# Altium schematic sheet drive.SchDoc
size A3
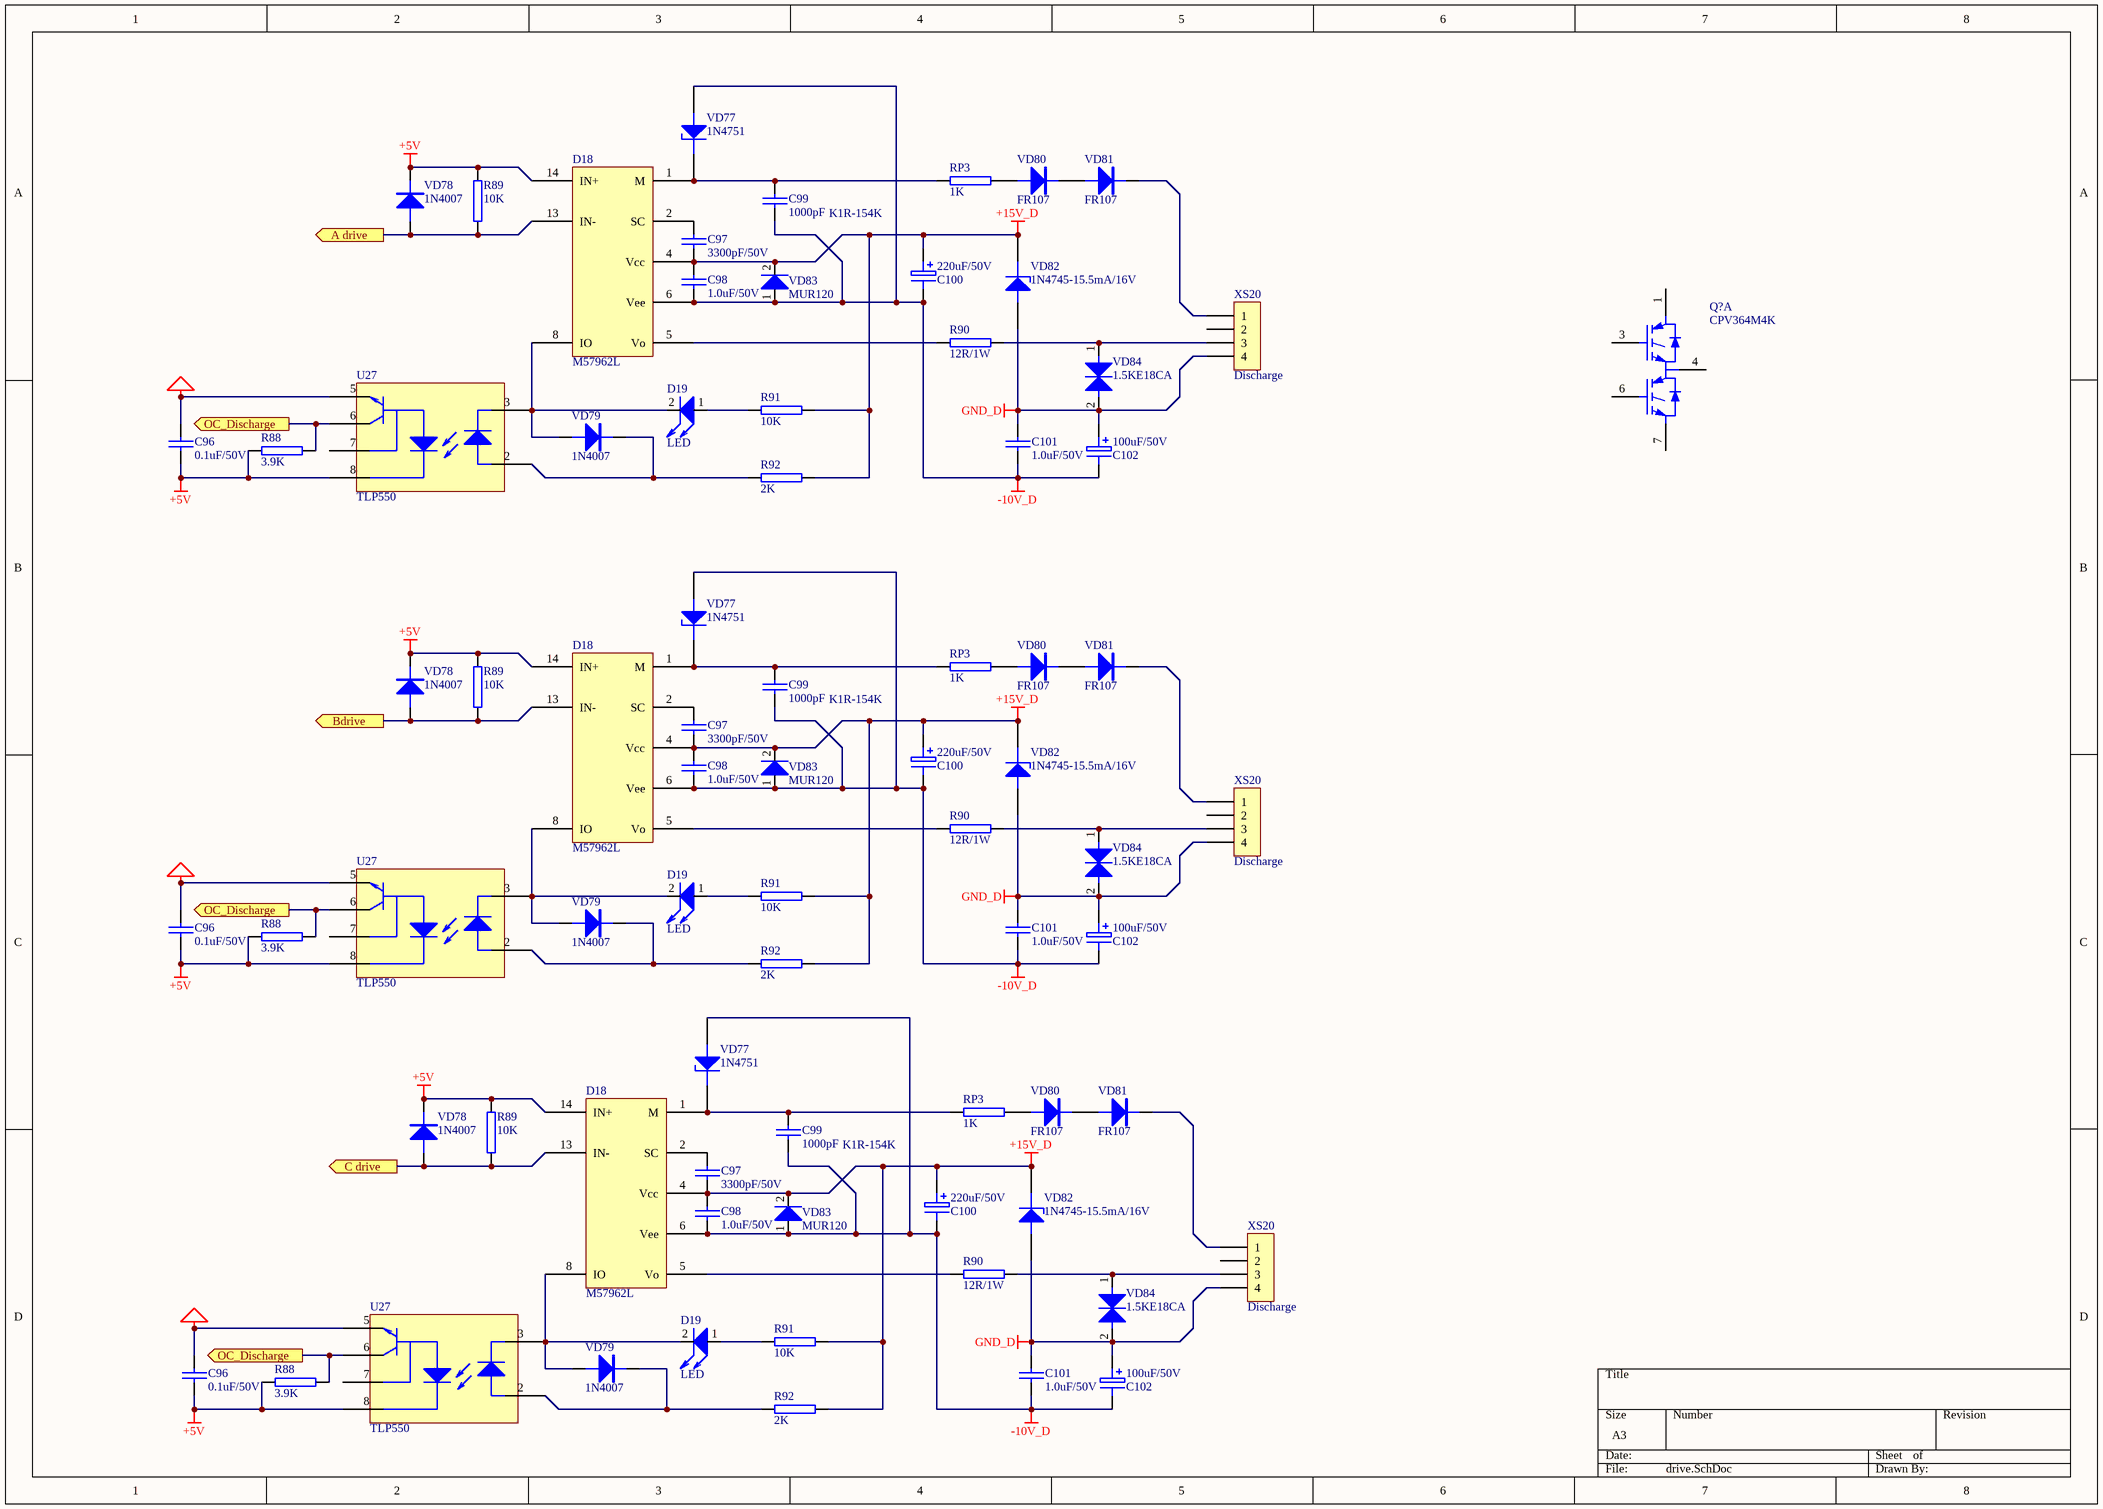
[diagram p0: drive.SchDoc]

## Parts
(Parts that share a designator on the sheet are numbered #1, #2 ... from top to bottom, then left to right.)
C96#1  0.1uF/50V  [RAD0.2]
C96#2  0.1uF/50V  [RAD0.2]
C96#3  0.1uF/50V  [RAD0.2]
C97#1  3300pF/50V  [RAD0.2]
C97#2  3300pF/50V  [RAD0.2]
C97#3  3300pF/50V  [RAD0.2]
C98#1  1.0uF/50V  [RAD0.2]
C98#2  1.0uF/50V  [RAD0.2]
C98#3  1.0uF/50V  [RAD0.2]
C99#1  1000pF  [RAD0.2]
C99#2  1000pF  [RAD0.2]
C99#3  1000pF  [RAD0.2]
C100#1  220uF/50V  [RB.2/.4]
C100#2  220uF/50V  [RB.2/.4]
C100#3  220uF/50V  [RB.2/.4]
C101#1  1.0uF/50V  [RAD0.2]
C101#2  1.0uF/50V  [RAD0.2]
C101#3  1.0uF/50V  [RAD0.2]
C102#1  100uF/50V  [RB.2/.4]
C102#2  100uF/50V  [RB.2/.4]
C102#3  100uF/50V  [RB.2/.4]
D18#1  M57962L  [IGBT-D579]
D18#2  M57962L  [IGBT-D579]
D18#3  M57962L  [IGBT-D579]
D19#1  LED  [RB.1/.2]
D19#2  LED  [RB.1/.2]
D19#3  LED  [RB.1/.2]
Q?  CPV364M4K  [IMS-2]  (part A of 3)
R88#1  3.9K  [AXIAL0.4]
R88#2  3.9K  [AXIAL0.4]
R88#3  3.9K  [AXIAL0.4]
R89#1  10K  [AXIAL0.4]
R89#2  10K  [AXIAL0.4]
R89#3  10K  [AXIAL0.4]
R90#1  12R/1W  [AXIAL0.6]
R90#2  12R/1W  [AXIAL0.6]
R90#3  12R/1W  [AXIAL0.6]
R91#1  10K  [AXIAL0.4]
R91#2  10K  [AXIAL0.4]
R91#3  10K  [AXIAL0.4]
R92#1  2K  [AXIAL0.4]
R92#2  2K  [AXIAL0.4]
R92#3  2K  [AXIAL0.4]
RP3#1  1K  [AXIAL0.4]
RP3#2  1K  [AXIAL0.4]
RP3#3  1K  [AXIAL0.4]
U27#1  TLP550  [DIP8]
U27#2  TLP550  [DIP8]
U27#3  TLP550  [DIP8]
VD77#1  1N4751  [DIODE0.4-5]
VD77#2  1N4751  [DIODE0.4-5]
VD77#3  1N4751  [DIODE0.4-5]
VD78#1  1N4007  [DIODE0.4_40]
VD78#2  1N4007  [DIODE0.4_40]
VD78#3  1N4007  [DIODE0.4_40]
VD79#1  1N4007  [DIODE0.4_40]
VD79#2  1N4007  [DIODE0.4_40]
VD79#3  1N4007  [DIODE0.4_40]
VD80#1  FR107  [DIODE0.4_40]
VD80#2  FR107  [DIODE0.4_40]
VD80#3  FR107  [DIODE0.4_40]
VD81#1  FR107  [DIODE0.4_40]
VD81#2  FR107  [DIODE0.4_40]
VD81#3  FR107  [DIODE0.4_40]
VD82#1  1N4745-15.5mA/16V  [DIODE0.4-5]
VD82#2  1N4745-15.5mA/16V  [DIODE0.4-5]
VD82#3  1N4745-15.5mA/16V  [DIODE0.4-5]
VD83#1  MUR120  [DIODE0.4-21]
VD83#2  MUR120  [DIODE0.4-21]
VD83#3  MUR120  [DIODE0.4-21]
VD84#1  1.5KE18CA  [DIODE0.4-23]
VD84#2  1.5KE18CA  [DIODE0.4-23]
VD84#3  1.5KE18CA  [DIODE0.4-23]
XS20#1  Discharge  [POWER4-1]
XS20#2  Discharge  [POWER4-1]
XS20#3  Discharge  [POWER4-1]

## Ports
A drive (out), Bdrive (out), C drive (out), OC_Discharge

## Nets
+5V: C96#1.2 C96#2.2 C96#3.2 D18#1.14(IN+) D18#2.14(IN+) D18#3.14(IN+) R88#1.2 R88#2.2 R88#3.2 R89#1.2 R89#2.2 R89#3.2 U27#1.8 U27#2.8 U27#3.8 VD78#1.K VD78#2.K VD78#3.K
+15V_D: C97#1.2 C97#2.2 C97#3.2 C98#1.1 C98#2.1 C98#3.1 C100#1.1 C100#2.1 C100#3.1 D18#1.4(Vcc) D18#2.4(Vcc) D18#3.4(Vcc) R91#1.1 R91#2.1 R91#3.1 R92#1.1 R92#2.1 R92#3.1 VD82#1.2(K) VD82#2.2(K) VD82#3.2(K) VD83#1.2 VD83#2.2 VD83#3.2
-10V_D: C98#1.2 C98#2.2 C98#3.2 C99#1.2 C99#2.2 C99#3.2 C100#1.2 C100#2.2 C100#3.2 C101#1.2 C101#2.2 C101#3.2 C102#1.2 C102#2.2 C102#3.2 D18#1.6(Vee) D18#2.6(Vee) D18#3.6(Vee) VD77#1.1(A) VD77#2.1(A) VD77#3.1(A) VD83#1.1 VD83#2.1 VD83#3.1
GND: C96#1.1 C96#2.1 C96#3.1 U27#1.5 U27#2.5 U27#3.5
GND_D: C101#1.1 C101#2.1 C101#3.1 C102#1.1 C102#2.1 C102#3.1 VD82#1.1(A) VD82#2.1(A) VD82#3.1(A) VD84#1.2 VD84#2.2 VD84#3.2 XS20#1.4 XS20#2.4 XS20#3.4
A drive: D18#1.13(IN-) R89#1.1 VD78#1.A ; port A drive
Bdrive: D18#2.13(IN-) R89#2.1 VD78#2.A ; port Bdrive
C drive: D18#3.13(IN-) R89#3.1 VD78#3.A ; port C drive
OC_Discharge: R88#1.1 R88#2.1 R88#3.1 U27#1.6 U27#2.6 U27#3.6 ; port OC_Discharge
NetC97#1_1: C97#1.1 D18#1.2(SC)
NetC97#2_1: C97#2.1 D18#2.2(SC)
NetC97#3_1: C97#3.1 D18#3.2(SC)
NetC99#1_1: C99#1.1 D18#1.1(M) RP3#1.2 VD77#1.2(K)
NetC99#2_1: C99#2.1 D18#2.1(M) RP3#2.2 VD77#2.2(K)
NetC99#3_1: C99#3.1 D18#3.1(M) RP3#3.2 VD77#3.2(K)
NetD18#1_5: D18#1.5(Vo) R90#1.1
NetD18#1_8: D18#1.8(IO) D19#1.2 U27#1.3 VD79#1.A
NetD18#2_5: D18#2.5(Vo) R90#2.1
NetD18#2_8: D18#2.8(IO) D19#2.2 U27#2.3 VD79#2.A
NetD18#3_5: D18#3.5(Vo) R90#3.1
NetD18#3_8: D18#3.8(IO) D19#3.2 U27#3.3 VD79#3.A
NetD19#1_1: D19#1.1 R91#1.2
NetD19#2_1: D19#2.1 R91#2.2
NetD19#3_1: D19#3.1 R91#3.2
NetR90#1_2: R90#1.2 VD84#1.1 XS20#1.3
NetR90#2_2: R90#2.2 VD84#2.1 XS20#2.3
NetR90#3_2: R90#3.2 VD84#3.1 XS20#3.3
NetR92#1_2: R92#1.2 U27#1.2 VD79#1.K
NetR92#2_2: R92#2.2 U27#2.2 VD79#2.K
NetR92#3_2: R92#3.2 U27#3.2 VD79#3.K
NetRP3#1_1: RP3#1.1 VD80#1.A
NetRP3#2_1: RP3#2.1 VD80#2.A
NetRP3#3_1: RP3#3.1 VD80#3.A
NetVD80#1_K: VD80#1.K VD81#1.A
NetVD80#2_K: VD80#2.K VD81#2.A
NetVD80#3_K: VD80#3.K VD81#3.A
NetVD81#1_K: VD81#1.K XS20#1.1
NetVD81#2_K: VD81#2.K XS20#2.1
NetVD81#3_K: VD81#3.K XS20#3.1

Not connected (* = marked no-connect by the designer): Q? 1(C) 3(G1) 4(OUT) 6(G2) 7(E); U27#1 7; U27#2 7; U27#3 7; XS20#1 2; XS20#2 2; XS20#3 2

## Notes on the sheet
- K1R-154K

## Library data of the parts
C96#1-C96#3 C97#1-C97#3 C98#1-C98#3 C99#1-C99#3 C101#1-C101#3 = CAP: Capacitor
C100#1-C100#3 C102#1-C102#3 = ELECTRO1: Electrolytic Capacitor
D19#1-D19#3 = DIODE1
Q? = CPV364M4K: IGBT Sip Module; Note: Pins 2, 5, 8, 11, 14 and 17 are not present; Published: 8-Jun-2000; LatestRevisionDate: 17-Jul-2002; LatestRevisionNote: Re-released for DXP Platform.; DatasheetVersion: Jul-1997; PackageVersion: Dec-1996; PackageReference: IMS-2; Publisher: Altium Limited; PackageDescription: SIP; 19 Leads (6 Absent); Body 62.4 x 7.9 mm (LxW typ); Pitch 2.54 mm; ComponentLink1Description: Manufacturer Link; ComponentLink1URL: http://www.irf.com/; ComponentLink2Description: Datasheet; ComponentLink2URL: http://www.irf.com/product-info/datasheets/data/cpv364m4k.pdf
R88#1-R88#3 R89#1-R89#3 R90#1-R90#3 R91#1-R91#3 R92#1-R92#3 RP3#1-RP3#3 = RES2
U27#1-U27#3 = HCPL4053
VD77#1-VD77#3 VD82#1-VD82#3 = ZENER1: Zener Diode
VD78#1-VD78#3 VD79#1-VD79#3 VD80#1-VD80#3 VD81#1-VD81#3 VD83#1-VD83#3 = DIODE
XS20#1-XS20#3 = CON4: Connector